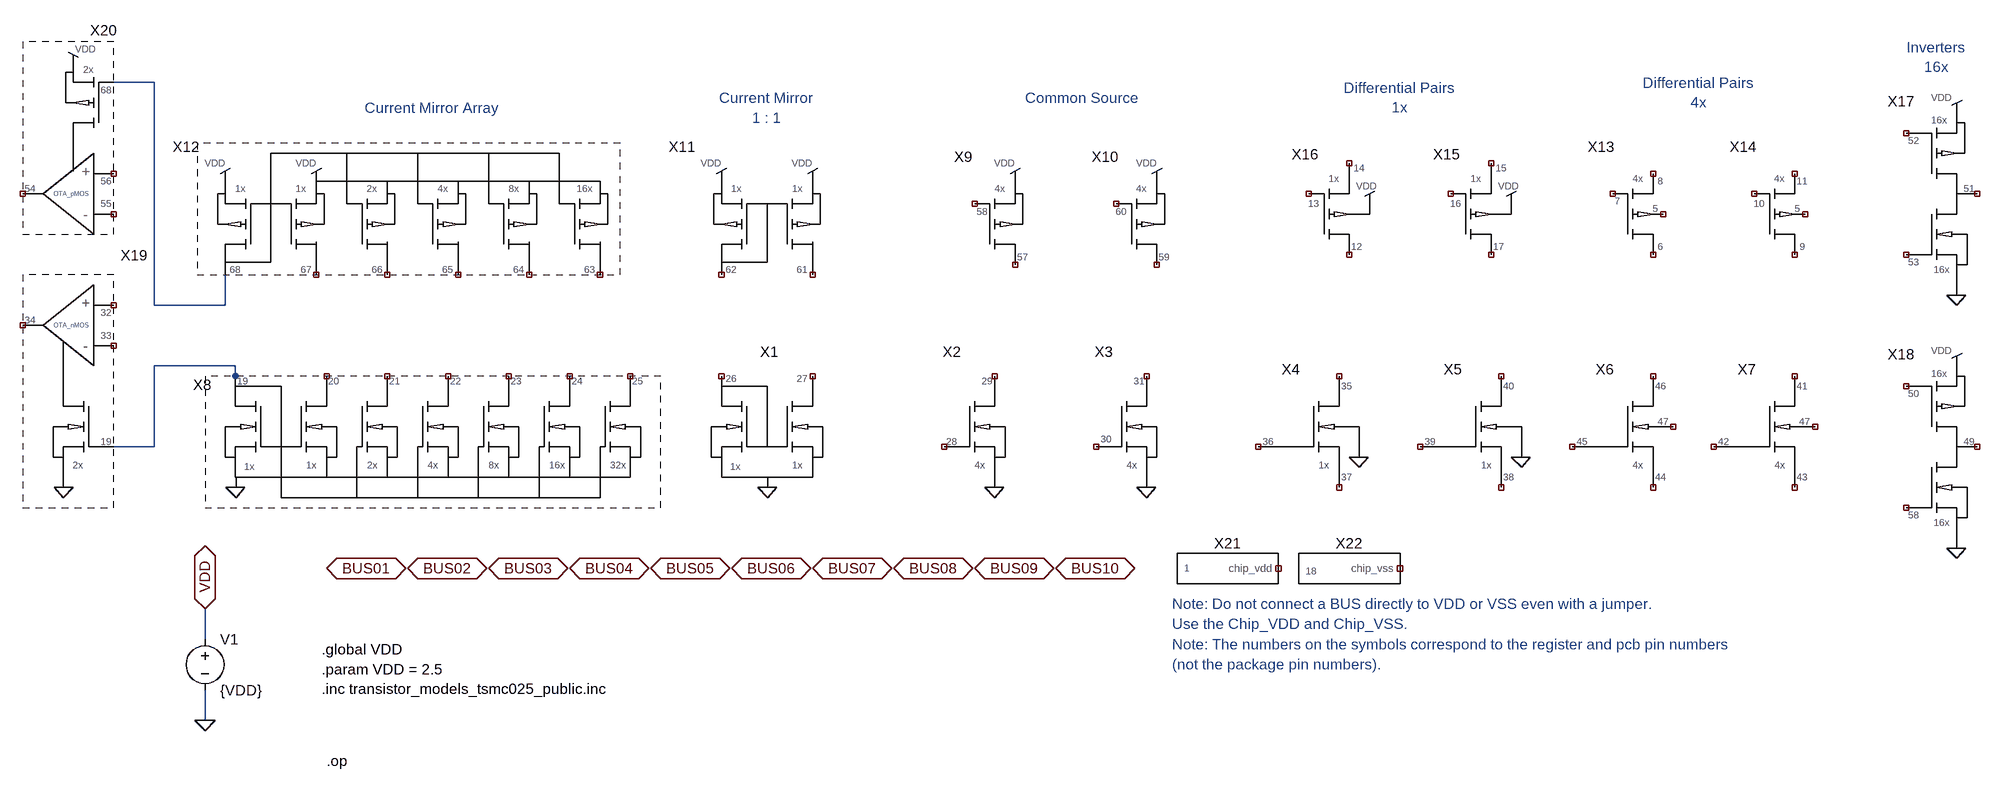
[diagram p0: schematic MobiusChip_v4b.asc]
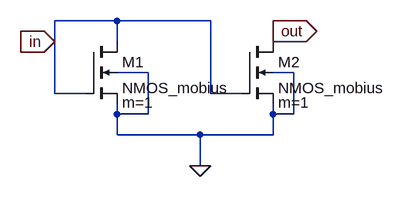
[diagram p1: sub-circuit nmos_currentmirror.asc]
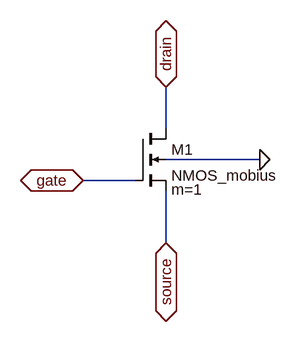
[diagram p2: sub-circuit dp_nmos_1x_b.asc]
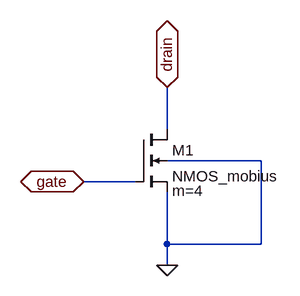
[diagram p3: sub-circuit cs_nmos_4x_a.asc]
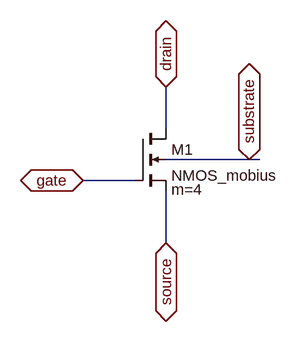
[diagram p4: sub-circuit dp_nmos_4x_b.asc]
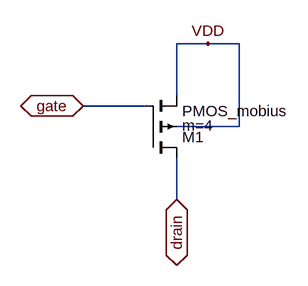
[diagram p5: sub-circuit cs_pmos_4x_a.asc]
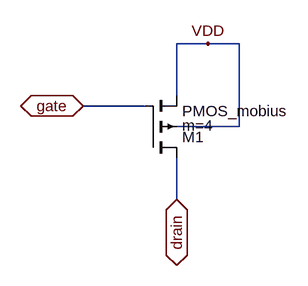
[diagram p6: sub-circuit cs_pmos_4x_b.asc]
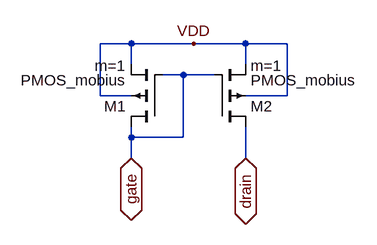
[diagram p7: sub-circuit pmos_currentmirror.asc]
MobiusChip_v4b.asc, the LTspice schematic file:
Version 4
SHEET 1 2156 996
WIRE -752 -352 -816 -352
WIRE -752 0 -752 -352
WIRE -640 0 -640 -48
WIRE -640 0 -752 0
WIRE -624 96 -752 96
WIRE -624 112 -624 96
WIRE -624 128 -624 112
WIRE -752 224 -752 96
WIRE -752 224 -816 224
WIRE -672 528 -672 480
WIRE -672 656 -672 608
FLAG -480 416 BUS01
IOPIN -480 416 BiDir
FLAG -352 416 BUS02
IOPIN -352 416 BiDir
FLAG -224 416 BUS03
IOPIN -224 416 BiDir
FLAG -96 416 BUS04
IOPIN -96 416 BiDir
FLAG 32 416 BUS05
IOPIN 32 416 BiDir
FLAG 160 416 BUS06
IOPIN 160 416 BiDir
FLAG 288 416 BUS07
IOPIN 288 416 BiDir
FLAG 416 416 BUS08
IOPIN 416 416 BiDir
FLAG 544 416 BUS09
IOPIN 544 416 BiDir
FLAG 672 416 BUS10
IOPIN 672 416 BiDir
FLAG -672 480 VDD
IOPIN -672 480 BiDir
FLAG -672 656 0
SYMBOL nMOS_currentMirror 240 144 R0
SYMATTR InstName X1
SYMBOL DP_nMOS_1x_A 1072 144 R0
SYMATTR InstName X4
SYMBOL DP_nMOS_1x_B 1328 144 R0
SYMATTR InstName X5
SYMBOL CS_nMOS_4x_A 528 144 R0
SYMATTR InstName X2
SYMBOL DP_nMOS_4x_A 1568 144 R0
SYMATTR InstName X6
SYMBOL DP_nMOS_4x_B 1792 144 R0
SYMATTR InstName X7
SYMBOL voltage -672 512 R0
SYMATTR InstName V1
SYMATTR Value {VDD}
SYMBOL CS_pMOS_4x_A 544 -176 R0
SYMATTR InstName X9
SYMBOL CS_pMOS_4x_B 768 -176 R0
SYMATTR InstName X10
SYMBOL pMOS_currentMirror 224 -176 R0
SYMATTR InstName X11
SYMBOL pMOS_currentMirror_array -560 -176 R0
WINDOW 0 -142 -59 Bottom 2
SYMATTR InstName X12
SYMBOL CS_nMOS_4x_B 768 144 R0
SYMATTR InstName X3
SYMBOL DP_pMOS_4x_A 1552 -192 R0
SYMATTR InstName X13
SYMBOL DP_pMOS_4x_B 1776 -192 R0
SYMATTR InstName X14
SYMBOL DP_pMOS_1x_B 1296 -192 R0
SYMATTR InstName X15
SYMBOL DP_pMOS_1x_A 1072 -192 R0
SYMATTR InstName X16
SYMBOL nMOS_currentMirror_array -528 144 R0
WINDOW 0 -148 -3 Bottom 2
SYMATTR InstName X8
SYMBOL inverter_A 2032 -288 R0
SYMATTR InstName X17
SYMBOL inverter_B 2032 112 R0
SYMATTR InstName X18
SYMBOL OTA_nMOS -816 -48 M0
SYMATTR InstName X19
SYMBOL OTA_pMOS -816 -368 M0
WINDOW 0 16 -51 Bottom 2
SYMATTR InstName X20
SYMBOL chip_vdd 944 416 R0
SYMATTR InstName X21
SYMBOL chip_vss 1136 416 R0
SYMATTR InstName X22
TEXT -488 544 Left 2 !.global VDD\n.param VDD = 2.5\n.inc transistor_models_tsmc025_public.inc
TEXT 624 -328 Left 2 ;Common Source
TEXT 1216 -328 Center 2 ;Differential Pairs\n1x
TEXT 1688 -336 Center 2 ;Differential Pairs\n4x
TEXT 216 -312 Center 2 ;Current Mirror\n1 : 1
TEXT -312 -312 Center 2 ;Current Mirror Array
TEXT 2064 -392 Center 2 ;Inverters\n16x
TEXT -480 720 Left 2 !.op
TEXT 856 472 Left 2 ;Note: Do not connect a BUS directly to VDD or VSS even with a jumper. \nUse the Chip_VDD and Chip_VSS.
TEXT 856 536 Left 2 ;Note: The numbers on the symbols correspond to the register and pcb pin numbers \n(not the package pin numbers).

nmos_currentmirror.asc, the sub-circuit schematic file:
Version 4
SHEET 1 880 680
WIRE 112 64 16 64
WIRE 256 64 112 64
WIRE 352 80 352 64
WIRE 16 96 16 64
WIRE 112 96 112 64
WIRE 352 96 352 80
WIRE 160 144 112 144
WIRE 384 144 352 144
WIRE 16 176 16 96
WIRE 64 176 16 176
WIRE 256 176 256 64
WIRE 304 176 256 176
WIRE 112 208 112 192
WIRE 160 208 160 144
WIRE 160 208 112 208
WIRE 352 208 352 192
WIRE 384 208 384 144
WIRE 384 208 352 208
WIRE 112 240 112 208
WIRE 240 240 112 240
WIRE 352 240 352 208
WIRE 352 240 240 240
WIRE 240 288 240 240
FLAG 352 80 out
IOPIN 352 80 Out
FLAG 16 96 in
IOPIN 16 96 In
FLAG 240 288 0
SYMBOL nmos4 64 96 R0
WINDOW 123 56 94 Left 2
SYMATTR InstName M1
SYMATTR Value NMOS_mobius
SYMATTR Prefix X
SYMATTR Value2 m=1
SYMBOL nmos4 304 96 R0
WINDOW 123 56 94 Left 2
SYMATTR InstName M2
SYMATTR Value NMOS_mobius
SYMATTR Prefix X
SYMATTR Value2 m=1

dp_nmos_1x_b.asc, the sub-circuit schematic file:
Version 4
SHEET 1 880 680
WIRE 288 192 288 128
WIRE 432 240 288 240
WIRE 240 272 160 272
WIRE 288 368 288 288
FLAG 432 240 0
FLAG 288 128 drain
IOPIN 288 128 BiDir
FLAG 288 368 source
IOPIN 288 368 BiDir
FLAG 160 272 gate
IOPIN 160 272 BiDir
SYMBOL nmos4 240 192 R0
WINDOW 123 56 94 Left 2
SYMATTR InstName M1
SYMATTR Value NMOS_mobius
SYMATTR Prefix X
SYMATTR Value2 m=1

cs_nmos_4x_a.asc, the sub-circuit schematic file:
Version 4
SHEET 1 880 680
WIRE 288 192 288 128
WIRE 432 240 288 240
WIRE 240 272 160 272
WIRE 288 368 288 288
WIRE 432 368 432 240
WIRE 432 368 288 368
WIRE 288 400 288 368
FLAG 288 128 drain
IOPIN 288 128 BiDir
FLAG 160 272 gate
IOPIN 160 272 BiDir
FLAG 288 400 0
SYMBOL nmos4 240 192 R0
WINDOW 123 56 94 Left 2
SYMATTR Value2 m=4
SYMATTR InstName M1
SYMATTR Value NMOS_mobius
SYMATTR Prefix X

dp_nmos_4x_b.asc, the sub-circuit schematic file:
Version 4
SHEET 1 880 680
WIRE 288 192 288 128
WIRE 416 240 288 240
WIRE 432 240 416 240
WIRE 240 272 160 272
WIRE 288 368 288 288
FLAG 288 128 drain
IOPIN 288 128 BiDir
FLAG 288 368 source
IOPIN 288 368 BiDir
FLAG 160 272 gate
IOPIN 160 272 BiDir
FLAG 416 240 substrate
IOPIN 416 240 BiDir
SYMBOL nmos4 240 192 R0
WINDOW 123 56 94 Left 2
SYMATTR Value2 m=4
SYMATTR InstName M1
SYMATTR Value NMOS_mobius
SYMATTR Prefix X

cs_pmos_4x_a.asc, the sub-circuit schematic file:
Version 4
SHEET 1 880 680
WIRE 256 176 208 176
WIRE 304 176 256 176
WIRE 208 256 208 176
WIRE 160 272 64 272
WIRE 304 304 304 176
WIRE 304 304 208 304
WIRE 208 416 208 352
FLAG 208 416 drain
IOPIN 208 416 BiDir
FLAG 64 272 gate
IOPIN 64 272 BiDir
FLAG 256 176 VDD
SYMBOL pmos4 160 352 M180
WINDOW 123 56 50 Left 2
SYMATTR Value2 m=4
SYMATTR InstName M1
SYMATTR Value PMOS_mobius
SYMATTR Prefix X

cs_pmos_4x_b.asc, the sub-circuit schematic file:
Version 4
SHEET 1 880 680
WIRE 256 176 208 176
WIRE 304 176 256 176
WIRE 208 256 208 176
WIRE 160 272 64 272
WIRE 304 304 304 176
WIRE 304 304 208 304
WIRE 208 416 208 352
FLAG 208 416 drain
IOPIN 208 416 BiDir
FLAG 64 272 gate
IOPIN 64 272 BiDir
FLAG 256 176 VDD
SYMBOL pmos4 160 352 M180
WINDOW 123 56 50 Left 2
SYMATTR Value2 m=4
SYMATTR InstName M1
SYMATTR Value PMOS_mobius
SYMATTR Prefix X

pmos_currentmirror.asc, the sub-circuit schematic file:
Version 4
SHEET 1 880 680
WIRE 336 160 288 160
WIRE 432 160 336 160
WIRE 512 160 432 160
WIRE 576 160 512 160
WIRE 336 192 336 160
WIRE 512 192 512 160
WIRE 416 208 384 208
WIRE 464 208 416 208
WIRE 288 240 288 160
WIRE 336 240 288 240
WIRE 576 240 576 160
WIRE 576 240 512 240
WIRE 336 304 336 288
WIRE 416 304 416 208
WIRE 416 304 336 304
WIRE 336 336 336 304
WIRE 512 336 512 288
FLAG 432 160 VDD
FLAG 336 336 gate
IOPIN 336 336 BiDir
FLAG 512 336 drain
IOPIN 512 336 BiDir
SYMBOL pmos4 384 288 R180
WINDOW 123 56 94 Left 2
SYMATTR Value2 m=1
SYMATTR InstName M1
SYMATTR Value PMOS_mobius
SYMATTR Prefix X
SYMBOL pmos4 464 288 M180
WINDOW 123 56 94 Left 2
SYMATTR Value2 m=1
SYMATTR InstName M2
SYMATTR Value PMOS_mobius
SYMATTR Prefix X

pmos_currentmirror_array.asc, the sub-circuit schematic file:
Version 4
SHEET 1 1552 680
WIRE 640 112 416 112
WIRE 864 112 640 112
WIRE 1088 112 864 112
WIRE 1312 112 1088 112
WIRE 336 160 288 160
WIRE 368 160 336 160
WIRE 512 160 368 160
WIRE 576 160 512 160
WIRE 720 160 576 160
WIRE 784 160 720 160
WIRE 944 160 784 160
WIRE 1008 160 944 160
WIRE 1168 160 1008 160
WIRE 1232 160 1168 160
WIRE 1392 160 1232 160
WIRE 1456 160 1392 160
WIRE 336 192 336 160
WIRE 512 192 512 160
WIRE 720 192 720 160
WIRE 944 192 944 160
WIRE 1168 192 1168 160
WIRE 1392 192 1392 160
WIRE 416 208 416 112
WIRE 416 208 384 208
WIRE 464 208 416 208
WIRE 640 208 640 112
WIRE 672 208 640 208
WIRE 864 208 864 112
WIRE 896 208 864 208
WIRE 1088 208 1088 112
WIRE 1120 208 1088 208
WIRE 1312 208 1312 112
WIRE 1344 208 1312 208
WIRE 288 240 288 160
WIRE 336 240 288 240
WIRE 576 240 576 160
WIRE 576 240 512 240
WIRE 784 240 784 160
WIRE 784 240 720 240
WIRE 1008 240 1008 160
WIRE 1008 240 944 240
WIRE 1232 240 1232 160
WIRE 1232 240 1168 240
WIRE 1456 240 1456 160
WIRE 1456 240 1392 240
WIRE 336 304 336 288
WIRE 416 304 416 208
WIRE 416 304 336 304
WIRE 336 336 336 304
WIRE 512 336 512 288
WIRE 720 336 720 288
WIRE 944 336 944 288
WIRE 1168 336 1168 288
WIRE 1392 336 1392 288
FLAG 368 160 VDD
FLAG 336 336 in
IOPIN 336 336 BiDir
FLAG 512 336 out1
IOPIN 512 336 BiDir
FLAG 720 336 out2
IOPIN 720 336 BiDir
FLAG 944 336 out4
IOPIN 944 336 BiDir
FLAG 1168 336 out8
IOPIN 1168 336 BiDir
FLAG 1392 336 out16
IOPIN 1392 336 BiDir
DATAFLAG 1168 112 "$"
SYMBOL pmos4 384 288 R180
WINDOW 123 56 94 Left 2
SYMATTR Value2 m=1
SYMATTR InstName M1
SYMATTR Value PMOS_mobius
SYMATTR Prefix X
SYMBOL pmos4 464 288 M180
WINDOW 123 56 94 Left 2
SYMATTR Value2 m=1
SYMATTR InstName M2
SYMATTR Value PMOS_mobius
SYMATTR Prefix X
SYMBOL pmos4 672 288 M180
WINDOW 123 56 94 Left 2
SYMATTR Value2 m=2
SYMATTR InstName M3
SYMATTR Value PMOS_mobius
SYMATTR Prefix X
SYMBOL pmos4 896 288 M180
WINDOW 123 56 94 Left 2
SYMATTR Value2 m=4
SYMATTR InstName M4
SYMATTR Value PMOS_mobius
SYMATTR Prefix X
SYMBOL pmos4 1120 288 M180
WINDOW 123 56 94 Left 2
SYMATTR Value2 m=8
SYMATTR InstName M5
SYMATTR Value PMOS_mobius
SYMATTR Prefix X
SYMBOL pmos4 1344 288 M180
WINDOW 123 56 94 Left 2
SYMATTR Value2 m=16
SYMATTR InstName M6
SYMATTR Value PMOS_mobius
SYMATTR Prefix X

dp_pmos_4x_a.asc, the sub-circuit schematic file:
Version 4
SHEET 1 880 680
WIRE 208 256 208 176
WIRE 160 272 64 272
WIRE 304 304 208 304
WIRE 208 416 208 352
FLAG 208 416 drain
IOPIN 208 416 BiDir
FLAG 64 272 gate
IOPIN 64 272 BiDir
FLAG 208 176 source
IOPIN 208 176 BiDir
FLAG 304 304 nwell
IOPIN 304 304 BiDir
SYMBOL pmos4 160 352 M180
WINDOW 123 56 50 Left 2
SYMATTR Value2 m=4
SYMATTR InstName M1
SYMATTR Value PMOS_mobius
SYMATTR Prefix X

dp_pmos_1x_a.asc, the sub-circuit schematic file:
Version 4
SHEET 1 880 680
WIRE 208 256 208 176
WIRE 160 272 64 272
WIRE 304 304 208 304
WIRE 208 416 208 352
FLAG 208 416 drain
IOPIN 208 416 BiDir
FLAG 64 272 gate
IOPIN 64 272 BiDir
FLAG 208 176 source
IOPIN 208 176 BiDir
FLAG 304 304 VDD
SYMBOL pmos4 160 352 M180
WINDOW 123 56 50 Left 2
SYMATTR Value2 m=1
SYMATTR InstName M1
SYMATTR Value PMOS_mobius
SYMATTR Prefix X

nmos_currentmirror_array.asc, the sub-circuit schematic file:
Version 4
SHEET 1 1796 680
WIRE 112 64 16 64
WIRE 256 64 112 64
WIRE 352 80 352 64
WIRE 624 80 624 64
WIRE 896 80 896 64
WIRE 1152 80 1152 64
WIRE 1392 80 1392 64
WIRE 1632 80 1632 64
WIRE 16 96 16 64
WIRE 112 96 112 64
WIRE 352 96 352 80
WIRE 624 96 624 80
WIRE 896 96 896 80
WIRE 1152 96 1152 80
WIRE 1392 96 1392 80
WIRE 1632 96 1632 80
WIRE 160 144 112 144
WIRE 384 144 352 144
WIRE 656 144 624 144
WIRE 928 144 896 144
WIRE 1184 144 1152 144
WIRE 1424 144 1392 144
WIRE 1664 144 1632 144
WIRE 16 176 16 96
WIRE 64 176 16 176
WIRE 256 176 256 64
WIRE 304 176 256 176
WIRE 112 208 112 192
WIRE 160 208 160 144
WIRE 160 208 112 208
WIRE 352 208 352 192
WIRE 384 208 384 144
WIRE 384 208 352 208
WIRE 624 208 624 192
WIRE 656 208 656 144
WIRE 656 208 624 208
WIRE 896 208 896 192
WIRE 928 208 928 144
WIRE 928 208 896 208
WIRE 1152 208 1152 192
WIRE 1184 208 1184 144
WIRE 1184 208 1152 208
WIRE 1392 208 1392 192
WIRE 1424 208 1424 144
WIRE 1424 208 1392 208
WIRE 1632 208 1632 192
WIRE 1664 208 1664 144
WIRE 1664 208 1632 208
WIRE 112 240 112 208
WIRE 352 240 352 208
WIRE 352 240 112 240
WIRE 624 240 624 208
WIRE 624 240 352 240
WIRE 896 240 896 208
WIRE 896 240 624 240
WIRE 1152 240 1152 208
WIRE 1152 240 896 240
WIRE 1392 240 1392 208
WIRE 1392 240 1152 240
WIRE 1632 240 1632 208
WIRE 1632 240 1392 240
WIRE 256 272 256 176
WIRE 576 272 576 176
WIRE 576 272 256 272
WIRE 848 272 848 176
WIRE 848 272 576 272
WIRE 1104 272 1104 176
WIRE 1104 272 848 272
WIRE 1344 272 1344 176
WIRE 1344 272 1104 272
WIRE 1584 272 1584 176
WIRE 1584 272 1344 272
WIRE 112 288 112 240
FLAG 352 80 out1
IOPIN 352 80 Out
FLAG 16 96 in
IOPIN 16 96 In
FLAG 112 288 0
FLAG 624 80 out2
IOPIN 624 80 Out
FLAG 896 80 out4
IOPIN 896 80 Out
FLAG 1152 80 out8
IOPIN 1152 80 Out
FLAG 1392 80 out16
IOPIN 1392 80 Out
FLAG 1632 80 out32
IOPIN 1632 80 Out
SYMBOL nmos4 64 96 R0
WINDOW 123 56 94 Left 2
SYMATTR Value2 m=1
SYMATTR InstName M1
SYMATTR Value NMOS_mobius
SYMATTR Prefix X
SYMBOL nmos4 304 96 R0
WINDOW 123 57 102 Left 2
SYMATTR Value2 m=1
SYMATTR InstName M2
SYMATTR Value NMOS_mobius
SYMATTR Prefix X
SYMBOL nmos4 576 96 R0
WINDOW 123 56 94 Left 2
SYMATTR Value2 m=2
SYMATTR InstName M3
SYMATTR Value NMOS_mobius
SYMATTR Prefix X
SYMBOL nmos4 848 96 R0
WINDOW 123 56 94 Left 2
SYMATTR Value2 m=4
SYMATTR InstName M4
SYMATTR Value NMOS_mobius
SYMATTR Prefix X
SYMBOL nmos4 1104 96 R0
WINDOW 123 56 94 Left 2
SYMATTR Value2 m=8
SYMATTR InstName M5
SYMATTR Value NMOS_mobius
SYMATTR Prefix X
SYMBOL nmos4 1344 96 R0
WINDOW 123 56 94 Left 2
SYMATTR Value2 m=16
SYMATTR InstName M6
SYMATTR Value NMOS_mobius
SYMATTR Prefix X
SYMBOL nmos4 1584 96 R0
WINDOW 123 56 94 Left 2
SYMATTR Value2 m=32
SYMATTR InstName M7
SYMATTR Value NMOS_mobius
SYMATTR Prefix X

inverter_a.asc, the sub-circuit schematic file:
Version 4
SHEET 1 880 680
WIRE 336 -80 288 -80
WIRE 384 -80 336 -80
WIRE 288 0 288 -80
WIRE 240 16 160 16
WIRE 384 48 384 -80
WIRE 384 48 288 48
WIRE 288 128 288 96
WIRE 288 192 288 128
WIRE 432 240 288 240
WIRE 240 272 160 272
WIRE 288 368 288 288
WIRE 432 368 432 240
WIRE 432 368 288 368
WIRE 288 400 288 368
FLAG 288 128 out
IOPIN 288 128 BiDir
FLAG 160 272 inn
IOPIN 160 272 BiDir
FLAG 288 400 0
FLAG 160 16 inp
IOPIN 160 16 BiDir
FLAG 336 -80 VDD
SYMBOL nmos4 240 192 R0
WINDOW 123 56 94 Left 2
SYMATTR Value2 m=16
SYMATTR InstName M1
SYMATTR Value NMOS_mobius
SYMATTR Prefix X
SYMBOL pmos4 240 96 M180
WINDOW 123 56 50 Left 2
SYMATTR Value2 m=16
SYMATTR InstName M2
SYMATTR Value PMOS_mobius
SYMATTR Prefix X

ota_nmos.asc, the sub-circuit schematic file:
Version 4
SHEET 1 880 680
WIRE 160 -272 64 -272
WIRE 304 -272 160 -272
WIRE 416 -272 304 -272
WIRE 512 -272 416 -272
WIRE 160 -192 160 -272
WIRE 416 -192 416 -272
WIRE 288 -176 208 -176
WIRE 368 -176 288 -176
WIRE 64 -144 64 -272
WIRE 160 -144 64 -144
WIRE 512 -144 512 -272
WIRE 512 -144 416 -144
WIRE 160 -64 160 -96
WIRE 224 -64 160 -64
WIRE 288 -64 288 -176
WIRE 288 -64 224 -64
WIRE 416 -64 416 -96
WIRE 528 -64 416 -64
WIRE 160 -32 160 -64
WIRE 416 -32 416 -64
WIRE 288 16 160 16
WIRE 416 16 288 16
WIRE 112 48 64 48
WIRE 288 48 288 16
WIRE 528 48 464 48
WIRE 160 128 160 64
WIRE 288 128 160 128
WIRE 352 128 288 128
WIRE 416 128 416 64
WIRE 416 128 352 128
WIRE 288 192 288 128
WIRE 432 240 288 240
WIRE 240 272 160 272
WIRE 288 368 288 288
WIRE 432 368 432 240
WIRE 432 368 288 368
WIRE 288 400 288 368
FLAG 160 272 biasn
IOPIN 160 272 BiDir
FLAG 288 400 0
FLAG 288 48 0
FLAG 304 -272 VDD
FLAG 528 -64 out
IOPIN 528 -64 BiDir
FLAG 528 48 inn
IOPIN 528 48 BiDir
FLAG 64 48 inp
IOPIN 64 48 BiDir
FLAG 352 128 co_so
FLAG 224 -64 out_b
SYMBOL nmos4 240 192 R0
WINDOW 123 56 94 Left 2
SYMATTR Value2 m=2
SYMATTR InstName M1
SYMATTR Value NMOS_mobius
SYMATTR Prefix X
SYMBOL nmos4 112 -32 R0
WINDOW 3 53 66 Left 2
SYMATTR Value NMOS_mobius
SYMATTR InstName M2
SYMATTR Prefix X
SYMATTR Value2 m=1
SYMBOL nmos4 464 -32 M0
WINDOW 3 53 105 Left 2
SYMATTR Value NMOS_mobius
SYMATTR InstName M3
SYMATTR Prefix X
SYMATTR Value2 m=1
SYMBOL pmos4 368 -96 M180
WINDOW 123 56 50 Left 2
SYMATTR Value2 m=1
SYMATTR InstName M4
SYMATTR Value PMOS_mobius
SYMATTR Prefix X
SYMBOL pmos4 208 -96 R180
WINDOW 123 56 50 Left 2
SYMATTR Value2 m=1
SYMATTR InstName M5
SYMATTR Value PMOS_mobius
SYMATTR Prefix X

ota_pmos.asc, the sub-circuit schematic file:
Version 4
SHEET 1 880 784
WIRE 256 176 208 176
WIRE 304 176 256 176
WIRE 208 256 208 176
WIRE 160 272 64 272
WIRE 304 304 304 176
WIRE 304 304 208 304
WIRE 208 416 208 352
WIRE 208 416 64 416
WIRE 256 416 208 416
WIRE 400 416 256 416
WIRE 64 432 64 416
WIRE 400 432 400 416
WIRE 16 448 -64 448
WIRE 528 448 448 448
WIRE 304 480 304 304
WIRE 304 480 64 480
WIRE 400 480 304 480
WIRE 400 560 400 528
WIRE 496 560 400 560
WIRE 64 576 64 528
WIRE 160 576 64 576
WIRE 208 576 160 576
WIRE 64 608 64 576
WIRE 400 608 400 560
WIRE 64 656 16 656
WIRE 432 656 400 656
WIRE 208 688 208 576
WIRE 208 688 112 688
WIRE 352 688 208 688
WIRE 16 720 16 656
WIRE 64 720 64 704
WIRE 64 720 16 720
WIRE 400 720 400 704
WIRE 432 720 432 656
WIRE 432 720 400 720
WIRE 64 752 64 720
WIRE 208 752 64 752
WIRE 400 752 400 720
WIRE 400 752 208 752
WIRE 208 768 208 752
FLAG 64 272 biasp
IOPIN 64 272 BiDir
FLAG 256 176 VDD
FLAG -64 448 inp
IOPIN -64 448 BiDir
FLAG 528 448 inn
IOPIN 528 448 BiDir
FLAG 496 560 out
IOPIN 496 560 Out
FLAG 208 768 0
FLAG 256 416 co_so
FLAG 160 576 out_b
SYMBOL pmos4 160 352 M180
WINDOW 123 56 50 Left 2
SYMATTR Value2 m=2
SYMATTR InstName M1
SYMATTR Value PMOS_mobius
SYMATTR Prefix X
SYMBOL pmos4 16 528 M180
WINDOW 123 56 50 Left 2
SYMATTR Value2 m=1
SYMATTR InstName M2
SYMATTR Value PMOS_mobius
SYMATTR Prefix X
SYMBOL pmos4 448 528 R180
WINDOW 123 56 50 Left 2
SYMATTR Value2 m=1
SYMATTR InstName M3
SYMATTR Value PMOS_mobius
SYMATTR Prefix X
SYMBOL nmos4 112 608 M0
WINDOW 123 56 94 Left 2
SYMATTR InstName M4
SYMATTR Value NMOS_mobius
SYMATTR Prefix X
SYMATTR Value2 m=1
SYMBOL nmos4 352 608 R0
WINDOW 123 56 94 Left 2
SYMATTR InstName M5
SYMATTR Value NMOS_mobius
SYMATTR Prefix X
SYMATTR Value2 m=1

chip_vdd.asc, the sub-circuit schematic file:
Version 4
SHEET 1 880 680
WIRE 0 208 -96 208
WIRE 48 208 0 208
WIRE 192 208 128 208
FLAG 192 208 chip_vdd
IOPIN 192 208 BiDir
FLAG 0 208 VDD
SYMBOL res 144 192 R90
WINDOW 0 0 56 VBottom 2
WINDOW 3 32 56 VTop 2
SYMATTR InstName R1
SYMATTR Value .000001

chip_vss.asc, the sub-circuit schematic file:
Version 4
SHEET 1 880 680
WIRE 160 272 80 272
WIRE 304 272 240 272
WIRE 80 368 80 272
FLAG 80 368 0
FLAG 304 272 chip_vss
IOPIN 304 272 BiDir
SYMBOL res 256 256 R90
WINDOW 0 0 56 VBottom 2
WINDOW 3 32 56 VTop 2
SYMATTR InstName R1
SYMATTR Value 0.000001

The netlist it stands for:
* MobiusChip_v4b.asc
XX1 NC_01 NC_02 nmos_currentmirror
XX4 NC_03 NC_04 NC_05 DP_nMOS_1x_A  ; pins gate drain source
XX5 NC_06 NC_07 NC_08 dp_nmos_1x_b
XX2 NC_09 NC_10 cs_nmos_4x_a
XX6 NC_11 NC_12 NC_13 NC_14 DP_nMOS_4x_A  ; pins gate drain source substrate
XX7 NC_15 NC_16 NC_17 NC_18 dp_nmos_4x_b
V1 VDD 0 {VDD}
XX9 NC_19 NC_20 cs_pmos_4x_a
XX10 NC_21 NC_22 cs_pmos_4x_b
XX11 NC_23 NC_24 pmos_currentmirror
XX12 N001 NC_25 NC_26 NC_27 NC_28 NC_29 pmos_currentmirror_array
XX3 NC_30 NC_31 CS_nMOS_4x_B  ; pins gate drain
XX13 NC_32 NC_33 NC_34 NC_35 dp_pmos_4x_a
XX14 NC_36 NC_37 NC_38 NC_39 DP_pMOS_4x_B  ; pins drain gate source nwell
XX15 NC_40 NC_41 NC_42 DP_pMOS_1x_B  ; pins drain gate source
XX16 NC_43 NC_44 NC_45 dp_pmos_1x_a
XX8 N002 NC_46 NC_47 NC_48 NC_49 NC_50 NC_51 nmos_currentmirror_array
XX17 NC_52 NC_53 NC_54 inverter_a
XX18 NC_55 NC_56 NC_57 inverter_B  ; pins inn inp out
XX19 N002 NC_58 NC_59 NC_60 ota_nmos
XX20 N001 NC_61 NC_62 NC_63 ota_pmos
XX21 NC_64 chip_vdd
XX22 NC_65 chip_vss

* block symbol definitions
.subckt nmos_currentmirror in out
XM1 in in 0 0 NMOS_mobius m=1  ; pins D G S B
XM2 out in 0 0 NMOS_mobius m=1  ; pins D G S B
.ends nmos_currentmirror

.subckt dp_nmos_1x_b gate drain source
XM1 drain gate source 0 NMOS_mobius m=1  ; pins D G S B
.ends dp_nmos_1x_b

.subckt cs_nmos_4x_a gate drain
XM1 drain gate 0 0 NMOS_mobius m=4  ; pins D G S B
.ends cs_nmos_4x_a

.subckt dp_nmos_4x_b gate drain source substrate
XM1 drain gate source substrate NMOS_mobius m=4  ; pins D G S B
.ends dp_nmos_4x_b

.subckt cs_pmos_4x_a drain gate
XM1 drain gate VDD VDD PMOS_mobius m=4  ; pins D G S B
.ends cs_pmos_4x_a

.subckt cs_pmos_4x_b drain gate
XM1 drain gate VDD VDD PMOS_mobius m=4  ; pins D G S B
.ends cs_pmos_4x_b

.subckt pmos_currentmirror gate drain
XM1 gate gate VDD VDD PMOS_mobius m=1  ; pins D G S B
XM2 drain gate VDD VDD PMOS_mobius m=1  ; pins D G S B
.ends pmos_currentmirror

.subckt pmos_currentmirror_array in out1 out2 out4 out8 out16
XM1 in in VDD VDD PMOS_mobius m=1  ; pins D G S B
XM2 out1 in VDD VDD PMOS_mobius m=1  ; pins D G S B
XM3 out2 in VDD VDD PMOS_mobius m=2  ; pins D G S B
XM4 out4 in VDD VDD PMOS_mobius m=4  ; pins D G S B
XM5 out8 in VDD VDD PMOS_mobius m=8  ; pins D G S B
XM6 out16 in VDD VDD PMOS_mobius m=16  ; pins D G S B
.ends pmos_currentmirror_array

.subckt dp_pmos_4x_a drain gate source nwell
XM1 drain gate source nwell PMOS_mobius m=4  ; pins D G S B
.ends dp_pmos_4x_a

.subckt dp_pmos_1x_a drain gate source
XM1 drain gate source VDD PMOS_mobius m=1  ; pins D G S B
.ends dp_pmos_1x_a

.subckt nmos_currentmirror_array in out1 out2 out4 out8 out16 out32
XM1 in in 0 0 NMOS_mobius m=1  ; pins D G S B
XM2 out1 in 0 0 NMOS_mobius m=1  ; pins D G S B
XM3 out2 in 0 0 NMOS_mobius m=2  ; pins D G S B
XM4 out4 in 0 0 NMOS_mobius m=4  ; pins D G S B
XM5 out8 in 0 0 NMOS_mobius m=8  ; pins D G S B
XM6 out16 in 0 0 NMOS_mobius m=16  ; pins D G S B
XM7 out32 in 0 0 NMOS_mobius m=32  ; pins D G S B
.ends nmos_currentmirror_array

.subckt inverter_a inn inp out
XM1 out inn 0 0 NMOS_mobius m=16  ; pins D G S B
XM2 out inp VDD VDD PMOS_mobius m=16  ; pins D G S B
.ends inverter_a

.subckt ota_nmos biasn inp inn out
XM1 co_so biasn 0 0 NMOS_mobius m=2  ; pins D G S B
XM2 out_b inp co_so 0 NMOS_mobius m=1  ; pins D G S B
XM3 out inn co_so 0 NMOS_mobius m=1  ; pins D G S B
XM4 out out_b VDD VDD PMOS_mobius m=1  ; pins D G S B
XM5 out_b out_b VDD VDD PMOS_mobius m=1  ; pins D G S B
.ends ota_nmos

.subckt ota_pmos biasp inp inn out
XM1 co_so biasp VDD VDD PMOS_mobius m=2  ; pins D G S B
XM2 out_b inp co_so VDD PMOS_mobius m=1  ; pins D G S B
XM3 out inn co_so VDD PMOS_mobius m=1  ; pins D G S B
XM4 out_b out_b 0 0 NMOS_mobius m=1  ; pins D G S B
XM5 out out_b 0 0 NMOS_mobius m=1  ; pins D G S B
.ends ota_pmos

.subckt chip_vdd chip_vdd
R1 chip_vdd VDD .000001
.ends chip_vdd

.subckt chip_vss chip_vss
R1 chip_vss 0 0.000001
.ends chip_vss

.global VDD
.param VDD = 2.5
.inc transistor_models_tsmc025_public.inc
* Common Source
* Differential Pairs
* 1x
* Differential Pairs
* 4x
* Current Mirror
* 1 : 1
* Current Mirror Array
* Inverters
* 16x
.op
* Note: Do not connect a BUS directly to VDD or VSS even with a jumper.
* Use the Chip_VDD and Chip_VSS.
* Note: The numbers on the symbols correspond to the register and pcb pin numbers
* (not the package pin numbers).
.backanno
.end